# Altium schematic sheet Spindle_Control.SchDoc: STM32F412 CNC
size B; Author: AM; CompanyName: Expatria Technologies; DrawnBy: A.Marles; Engineer: AM; Organization: Expatria Technolgoies; Address1: PO Box 2084; Address3: Merritt, BC V1K 1B8; Address4: Canada; DocumentNumber: 23; SheetNumber: 23; SheetTotal: 27
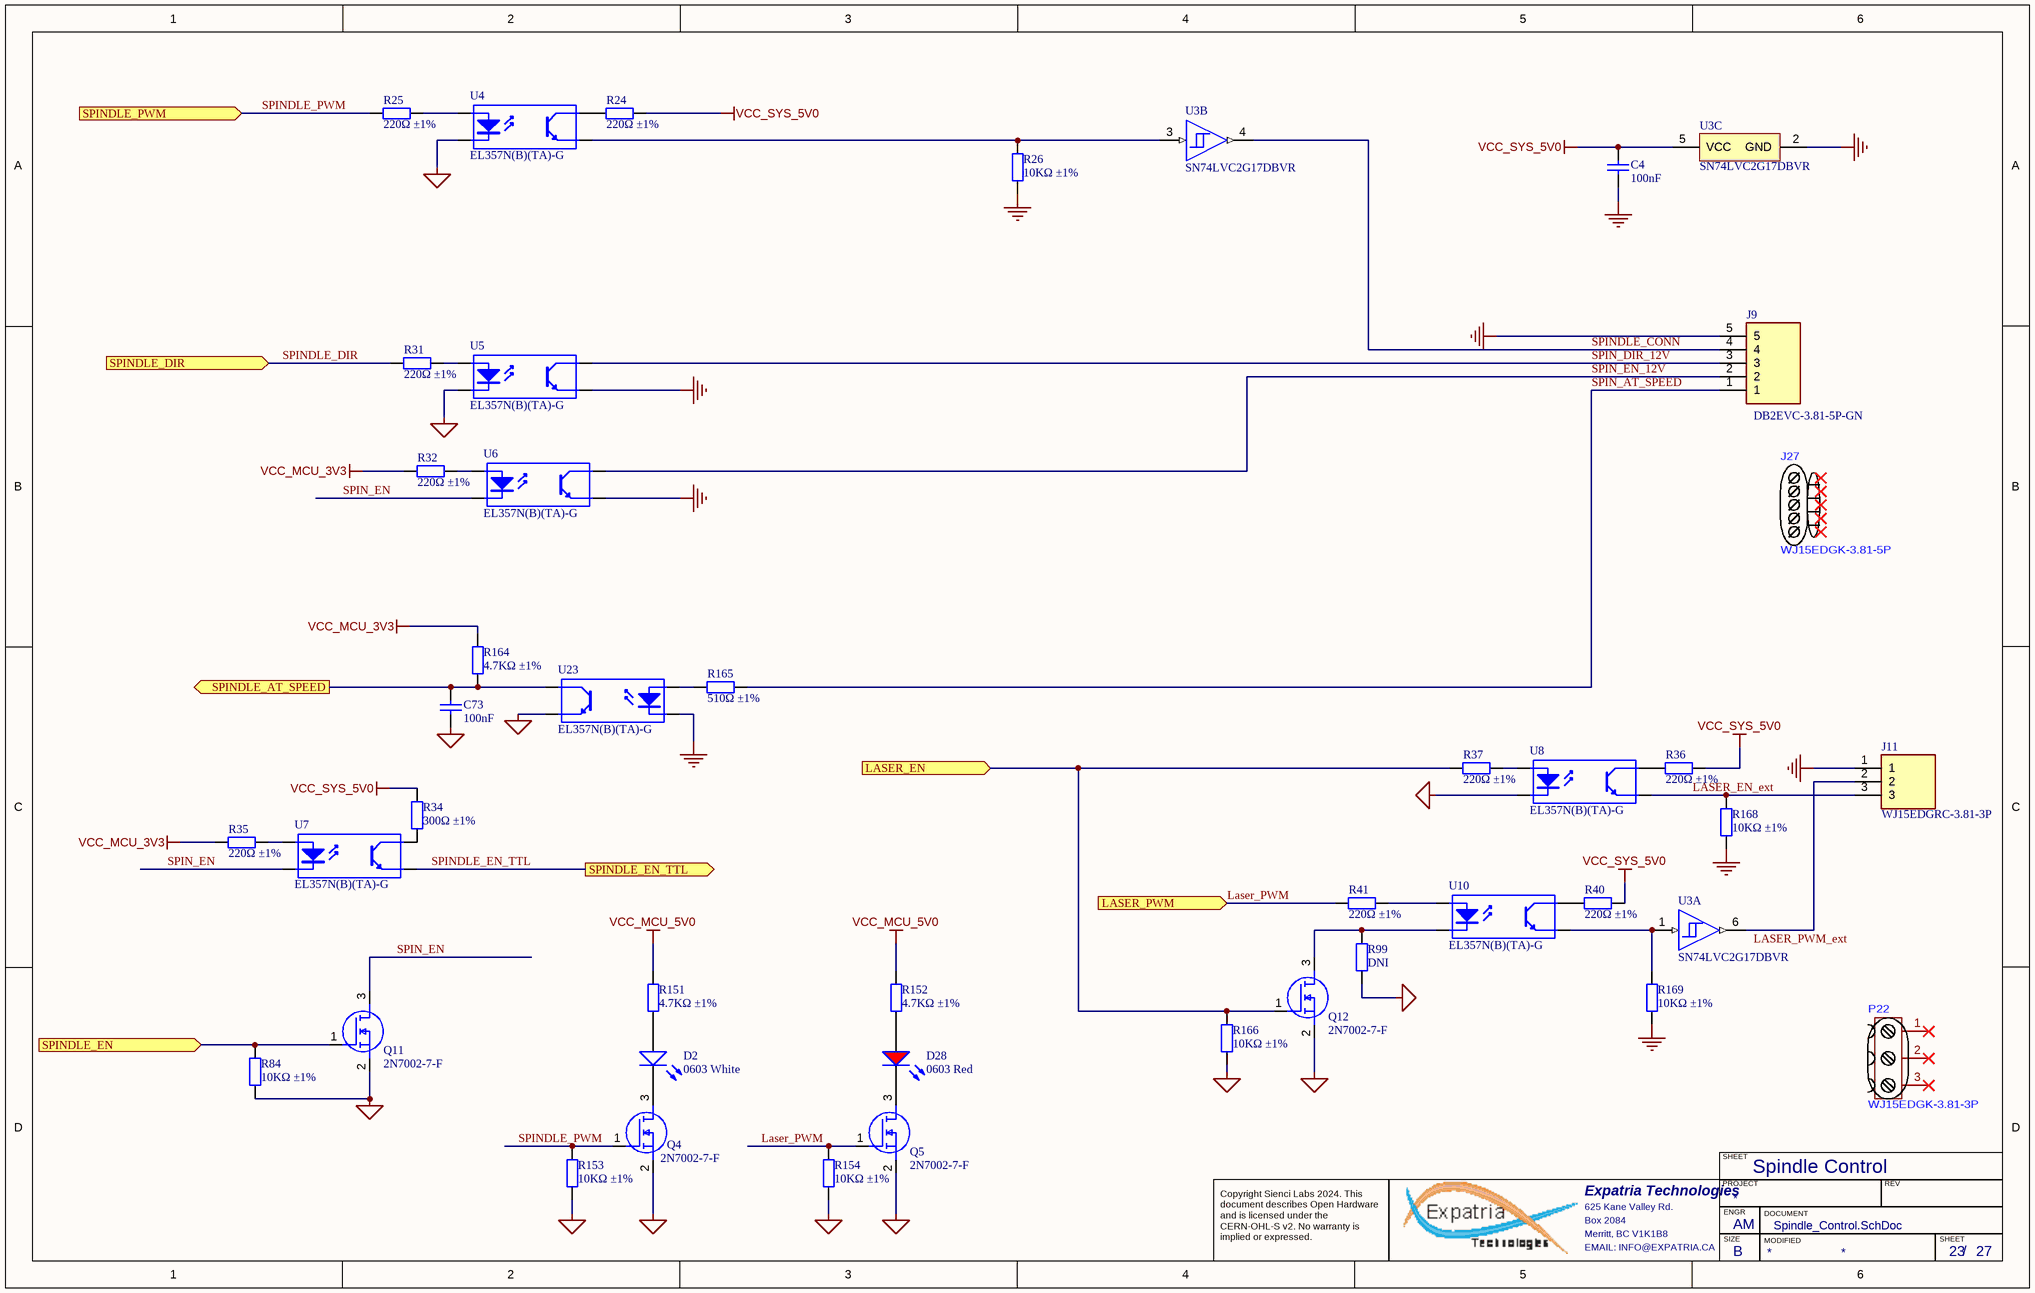
[diagram p0: Spindle_Control.SchDoc]

## Parts
C4  100nF  [0603_C]
C73  100nF  [0402_C]
D2  0603 White  [0603_LED_S1 - white]
D28  0603 Red  [0603_LED_S1]
J9  DB2EVC-3.81-5P-GN  [CONN-TH_5P-P3.81_DB2EVC-3.81-5P]
J11  WJ15EDGRC-3.81-3P  [SHDRRA3W85P0X381_1X3_1231X915X720P]
J27  WJ15EDGK-3.81-5P  (mechanical)
P22  WJ15EDGK-3.81-3P  (mechanical)
Q4  2N7002-7-F  [SOT-23(SOT-23-3)]
Q5  2N7002-7-F  [SOT-23(SOT-23-3)]
Q11  2N7002-7-F  [SOT-23(SOT-23-3)]
Q12  2N7002-7-F  [SOT-23(SOT-23-3)]
R24  220Ω ±1%  [0402_R]
R25  220Ω ±1%  [0402_R]
R26  10KΩ ±1%  [0402_R]
R31  220Ω ±1%  [0402_R]
R32  220Ω ±1%  [0402_R]
R34  300Ω ±1%  [0603_R]
R35  220Ω ±1%  [0402_R]
R36  220Ω ±1%  [0402_R]
R37  220Ω ±1%  [0402_R]
R40  220Ω ±1%  [0402_R]
R41  220Ω ±1%  [0402_R]
R84  10KΩ ±1%  [0402_R]
R99  DNI  [0603_R]
R151  4.7KΩ ±1%  [0402_R]
R152  4.7KΩ ±1%  [0402_R]
R153  10KΩ ±1%  [0402_R]
R154  10KΩ ±1%  [0402_R]
R164  4.7KΩ ±1%  [0402_R]
R165  510Ω ±1%  [0402_R]
R166  10KΩ ±1%  [0402_R]
R168  10KΩ ±1%  [0402_R]
R169  10KΩ ±1%  [0402_R]
U3  SN74LVC2G17DBVR  [DBV0006A_N]  (parts A,B,C of 3)
U4  EL357N(B)(TA)-G  [SOP-4_P2.54]
U5  EL357N(B)(TA)-G  [SOP-4_P2.54]
U6  EL357N(B)(TA)-G  [SOP-4_P2.54]
U7  EL357N(B)(TA)-G  [SOP-4_P2.54]
U8  EL357N(B)(TA)-G  [SOP-4_P2.54]
U10  EL357N(B)(TA)-G  [SOP-4_P2.54]
U23  EL357N(B)(TA)-G  [SOP-4_P2.54]

## Ports
LASER_EN (in), LASER_PWM (in), SPINDLE_AT_SPEED (out), SPINDLE_DIR (in), SPINDLE_EN (in), SPINDLE_EN_TTL (out), SPINDLE_PWM (in)

## Nets
GND: C4.1 J9.5 J11.1 R26.1 R168.1 R169.1 U3.2(GND) U5.3(E) U6.3(E) U23.2(K)
MCU_GND: C73.1 Q4.2(S) Q5.2(S) Q11.2(S) Q12.2(S) R84.1 R99.2 R153.1 R154.1 R166.1 U4.2(K) U5.2(K) U8.2(K) U23.3(E)
VCC_MCU_3V3: R32.1 R35.1 R164.1
VCC_MCU_5V0: R151.2 R152.2
VCC_SYS_5V0: C4.2 R24.2 R34.1 R36.2 R40.1 U3.5(VCC)
LASER_EN: Q12.1(G) R37.1 R166.2 ; port LASER_EN
LASER_EN_ext: J11.3 R168.2 U8.3(E)
Laser_PWM: Q5.1(G) R41.1 R154.2 ; port LASER_PWM
LASER_PWM_ext: J11.2 U3.6(1Y)
SPIN_AT_SPEED: J9.1 R165.1
SPIN_DIR_12V: J9.3 U5.4(C)
SPIN_EN: Q11.3(D) U6.2(K) U7.2(K)
SPIN_EN_12V: J9.2 U6.4(C)
SPINDLE_AT_SPEED: C73.2 R164.2 U23.4(C) ; port SPINDLE_AT_SPEED
SPINDLE_CONN: J9.4 U3.4(2Y)
SPINDLE_DIR: R31.1 ; port SPINDLE_DIR
SPINDLE_EN: Q11.1(G) R84.2 ; port SPINDLE_EN
SPINDLE_EN_TTL: U7.3(E) ; port SPINDLE_EN_TTL
SPINDLE_PWM: Q4.1(G) R25.1 R153.2 ; port SPINDLE_PWM
NetD2_A: D2.A R151.1
NetD2_K: D2.K Q4.3(D)
NetD28_A: D28.A R152.1
NetD28_K: D28.K Q5.3(D)
NetQ12_3: Q12.3(D) R99.1 U10.2(K)
NetR24_1: R24.1 U4.4(C)
NetR25_2: R25.2 U4.1(A)
NetR26_2: R26.2 U3.3(2A) U4.3(E)
NetR31_2: R31.2 U5.1(A)
NetR32_2: R32.2 U6.1(A)
NetR34_2: R34.2 U7.4(C)
NetR35_2: R35.2 U7.1(A)
NetR36_1: R36.1 U8.4(C)
NetR37_2: R37.2 U8.1(A)
NetR40_2: R40.2 U10.4(C)
NetR41_2: R41.2 U10.1(A)
NetR165_2: R165.2 U23.1(A)
NetR169_2: R169.2 U3.1(1A) U10.3(E)

Not connected (* = marked no-connect by the designer): P22 1* 2* 3*

## Notes on the sheet
- Spindle Control
- SHEET
- Expatria Technologies
- 625 Kane Valley Rd.
- Box 2084
- Merritt, BC V1K1B8
- PROJECT
- SIZE
- ENGR
- MODIFIED
- DOCUMENT
- REV
- Copyright Sienci Labs 2024. This document describes Open Hardware and is licensed under the CERN-OHL-S v2. No warranty is implied or expressed.
- EMAIL: INFO@EXPATRIA.CA
- B
- /

## Library data of the parts
C4 = 0603 100nF (104) 10% 50V: 50V 100nF X7R ±10% 0603 Multilayer Ceramic Capacitors MLCC - SMD/SMT ROHS; Manufacturer: YAGEO; Manufacturer Part Number: CC0603KRX7R9BB104; ComponentLink1Description: Supplier link; ComponentLink1URL: http://www.szlcsc.com/product/details_15331.html; Package: 0603; Supplier: LC; SuppliersPartNumber: C14663; Capacitance: 100nF; Tolerance: 10%; Voltage: 50V
C73 = 0402 100nF (104) 10% 16V: 16V 100nF X7R ±10% 0402 Multilayer Ceramic Capacitors MLCC - SMD/SMT ROHS; Manufacturer: Samsung Electro-Mechanics; Manufacturer Part Number: CL05B104KO5NNNC; ComponentLink1Description: Supplier link; ComponentLink1URL: http://www.szlcsc.com/product/details_1877.html; Package: 0402; Supplier: LC; SuppliersPartNumber: C1525; Capacitance: 100nF; Tolerance: 10%; Voltage: 16V
D2 = 19-218/T1D-CQ2R2TY/3T: White LED; Manufacturer: Everlight Elec; Package: 0603; Supplier: LC; SuppliersPartNumber: C1322288; Color: White; Manufacturer Part Number: 19-218/T1D-CQ2R2TY/3T
D28 = KT-0603R: -40℃~+85℃ Red 0603 Light Emitting Diodes (LED) ROHS; Manufacturer: Hubei KENTO Elec; Package: 0603; Supplier: LC; SuppliersPartNumber: C2286; Color: Red; Manufacturer Part Number: KT-0603R; Value: 0603 Red
J9 = DB2EVC-3.81-5P-GN: 3.81mm Green Board Edge/Receptacle-Close Push-Pull,P=3.81mm Pluggable System Terminal Block ROHS; Manufacturer: DIBO; SuppliersPartNumber: C395701; Manufacturer Part Number: DB2EVC-3.81-5P-GN; Supplier: LCSC; Value: DB2EVC-3.81-5P-GN
J11 = WJ15EDGRC-3.81-3P: 3.81mm Green Board Edge/Receptacle-Close Push-Pull,P=3.81mm Pluggable System Terminal Block ROHS; Manufacturer: Ningbo Kangnex; SuppliersPartNumber: C8406; Datasheet Link: https://datasheet.lcsc.com/szlcsc/1912251633_Ningbo-Kangnex-Elec-WJ15EDGRC-3-81-3P_C8406.pdf; Height: 7.2mm; Manufacturer Part Number: WJ15EDGRC-3.81-3P
J27 = WJ15EDGK-3.81-5P: 3.81mm Green Plug P=3.81mm Pluggable System Terminal Block ROHS; Manufacturer: Ningbo Kangnex Elec; SuppliersPartNumber: C3804; Manufacturer Part Number: WJ15EDGK-3.81-5P; Supplier: LCSC
P22 = WJ15EDGK-3.81-3P: 3.81mm Green Plug P=3.81mm Pluggable System Terminal Block ROHS; Manufacturer: Ningbo; Value: WJ15EDGK-3.81-3P; SuppliersPartNumber: C8413; Supplier: LCSC; Manufacturer Part Number: WJ15EDGK-3.81-3P
Q4 Q5 Q11 Q12 = 2N7002-7-F: 60V 115mA 7.5Ω@5V,50mA 370mW N Channel SOT-23 MOSFETs ROHS; Manufacturer: Diodes Inc.; SuppliersPartNumber: C85049; Manufacturer Part Number: 2N7002-7-F; Value: 2N7002-7-F; Datasheet Link: https://datasheet.datasheetarchive.com/originals/distributors/SFDatasheet-0/sf-0003625.pdf; Height: 1.2mm; Manufacturer_Part_Number: 2N7002-7-F; Mouser Part Number: 621-2N7002-F; Mouser Price/Stock: https://www.mouser.co.uk/ProductDetail/Diodes-Incorporated/2N7002-7-F?qs=jMXWnm70%252BC%252BAX%252BMLzUkTZg%3D%3D; Arrow Part Number: 2N7002-7-F; Arrow Price/Stock: https://www.arrow.com/en/products/2n7002-7-f/diodes-incorporated?region=nac
R24 R25 R31 R32 R35-R37 R40 R41 = 0402 220R (2200) 1%: Chip resistor; Manufacturer: Uniroyal Elec; Manufacturer Part Number: 0402WGF2200TCE; Power: 1/16W; ComponentLink1Description: Supplier link; ComponentLink1URL: http://www.szlcsc.com/product/details_25834.html; Package: 0402; Supplier: LC; SuppliersPartNumber: C25091; Resistance: 220Ω; Tolerance: 1%
R26 R84 R153 R154 R166 R168 R169 = 0402 10K (1002) 1%: Chip resistor; Manufacturer: Uniroyal Elec; Manufacturer Part Number: 0402WGF1002TCE; Power: 1/16W; Package: 0402; Supplier: LC; SuppliersPartNumber: C25744; Resistance: 10KΩ; Tolerance: 1%; ComponentLink1Description: Supplier link; ComponentLink1URL: http://www.szlcsc.com/product/details_26487.html
R34 = 0603 300R (3000) 1%: Chip resistor; Manufacturer: Uniroyal Elec; Manufacturer Part Number: 0603WAF3000T5E; Power: 1/10W; Package: 0603; Supplier: LCSC; SuppliersPartNumber: C23025; Resistance: 300Ω; Tolerance: 1%; ComponentLink1Description: Supplier link; ComponentLink1URL: http://www.szlcsc.com/product/details_23752.html
R99 = 0603 0R (0R0) 1%: Chip resistor; Manufacturer: Uniroyal Elec; Manufacturer Part Number: 0603WAF0000T5E; Power: 1/10W; Resistance: 0Ω; Tolerance: 1%; ComponentLink1Description: Supplier link; ComponentLink1URL: http://www.szlcsc.com/product/details_21903.html; Package: 0603; Supplier: LC; SuppliersPartNumber: C21189
R151 R152 R164 = 0402 4.7K (4701) 1%: Chip resistor; Manufacturer: Uniroyal Elec; Manufacturer Part Number: 0402WGF4701TCE; Power: 1/16W; ComponentLink1Description: Supplier link; ComponentLink1URL: http://www.szlcsc.com/product/details_26643.html; Package: 0402; Supplier: LC; SuppliersPartNumber: C25900; Resistance: 4.7KΩ; Tolerance: 1%
R165 = 0402 510R (5100) 1%: Chip resistor; Manufacturer: Uniroyal Elec; Manufacturer Part Number: 0402WGF5100TCE; Power: 1/16W; ComponentLink1Description: Supplier link; ComponentLink1URL: http://www.szlcsc.com/product/details_25866.html; Package: 0402; Supplier: LC; SuppliersPartNumber: C25123; Resistance: 510Ω; Tolerance: 1%
U3 = CMP-0859-00225-4: Dual Schmitt-Trigger Buffer, DBV0006A, LARGE T&R; Manufacturer: Texas Instruments; F @ Nom Voltage(Max)(Mhz): 150; VCC(Max)(V): 5.5; tpd @ Nom Voltage(Max)(ns): 9.3,5.7,5.4,4.3; Sub-Family: Non-Inverting Buffer/Driver; Output Drive (IOL/IOH)(Max)(mA): 32/-32; Output Type: CMOS; Voltage(Nom)(V): 1.8,2.5,3.3,5; ICC @ Nom Voltage(Max)(mA): 0.01; Schmitt Trigger: Yes; Technology Family: LVC; VCC(Min)(V): 1.65; 3-State Output: No; Rating: Catalog; Bits(#): 2; Input Type: CMOS/TTL; Logic: True; DatasheetVersion: SCES381N; Generic Part Number: SN74LVC2G17; PackageReference: DBV0006A; Operating Temperature Range(C): -40 to 125,-40 to 85; SuppliersPartNumber: C10429; Value: SN74LVC2G17DBVR; Manufacturer Part Number: SN74LVC2G17DBVR
U4-U8 U10 U23 = EL357N(B)(TA)-G_[C6649]: Optocoupler SOP-4, EL357N(B)(TA)-G, Everlight Electronics; Package: SOP-4_P2.54; Supplier: LC; SuppliersPartNumber: C6649; Manufacturer: Everlight; Manufacturer Part Number: EL357N(B)(TA)-G